# Altium schematic sheet NetCamera.SchDoc
size A3
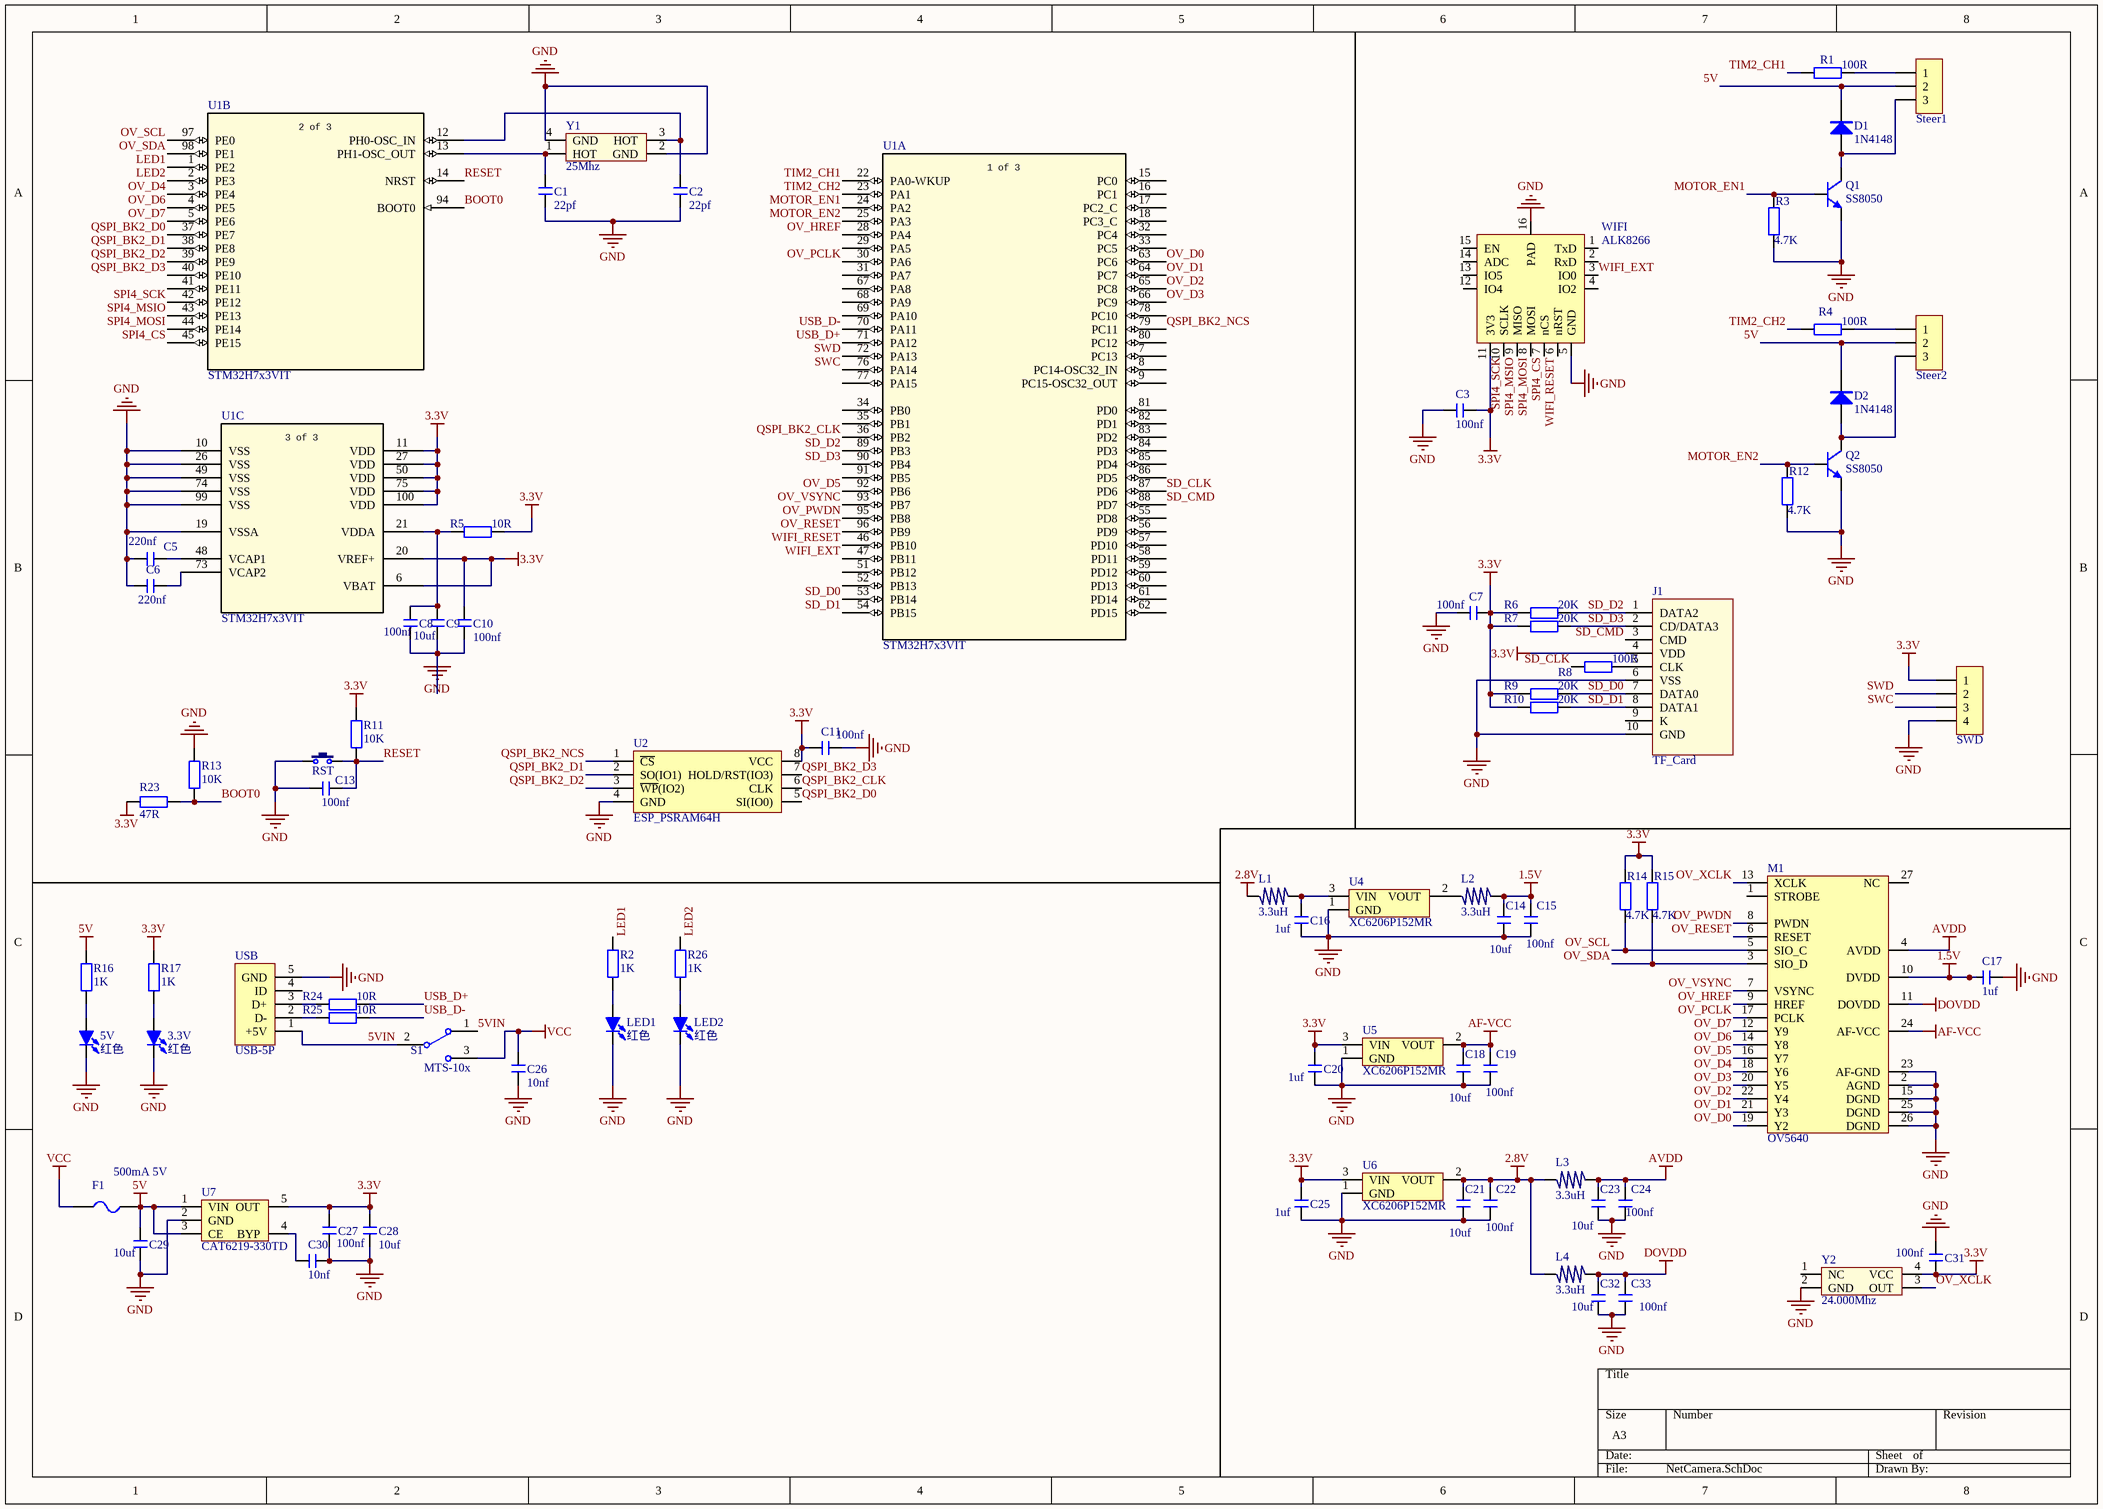
[diagram p0: NetCamera.SchDoc]

## Parts
3.3V  红色  [LED 0603R]
5V  红色  [LED 0603R]
C1  22pf  [C 0603_L]
C2  22pf  [C 0603_L]
C3  100nf  [C 0603_L]
C5  220nf  [C 0603_L]
C6  220nf  [C 0603_L]
C7  100nf  [C 0603_L]
C8  100nf  [C 0603_L]
C9  10uf  [C 0603_L]
C10  100nf  [C 0603_L]
C11  100nf  [C 0603_L]
C13  100nf  [C 0603_L]
C14  10uf  [C 0805_L]
C15  100nf  [C 0603_L]
C16  1uf  [C 0603_L]
C17  1uf  [C 0805_L]
C18  10uf  [C 0805_L]
C19  100nf  [C 0603_L]
C20  1uf  [C 0603_L]
C21  10uf  [C 0805_L]
C22  100nf  [C 0603_L]
C23  10uf  [C 0805_L]
C24  100nf  [C 0603_L]
C25  1uf  [C 0603_L]
C26  10nf  [C 0805_L]
C27  100nf  [C 0603_L]
C28  10uf  [C 0805_L]
C29  10uf  [C 0603_L]
C30  10nf  [C 0603_L]
C31  100nf  [C 0603_L]
C32  10uf  [C 0805_L]
C33  100nf  [C 0603_L]
D1  1N4148  [SOD-323]
D2  1N4148  [SOD-323]
F1  500mA 5V  [FU 0805]
J1  TF_Card  [Micro SD]
L1  3.3uH  [L 0805]
L2  3.3uH  [L 0805]
L3  3.3uH  [L 0805]
L4  3.3uH  [L 0805]
LED1  红色  [LED 0603R]
LED2  红色  [LED 0603R]
M1  OV5640  [OV5640-24]
Q1  SS8050  [SOT23-3N]
Q2  SS8050  [SOT23-3N]
R1  100R  [R 0603_L]
R2  1K  [R 0603_L]
R3  4.7K  [R 0603_L]
R4  100R  [R 0603_L]
R5  10R  [R 0603_L]
R6  20K  [R 0603_L]
R7  20K  [R 0603_L]
R8  100R  [R 0603_L]
R9  20K  [R 0603_L]
R10  20K  [R 0603_L]
R11  10K  [R 0603_L]
R12  4.7K  [R 0603_L]
R13  10K  [R 0603_L]
R14  4.7K  [R 0603_L]
R15  4.7K  [R 0603_L]
R16  1K  [R 0603_L]
R17  1K  [R 0603_L]
R23  47R  [R 0603_L]
R24  10R  [R 0603_L]
R25  10R  [R 0603_L]
R26  1K  [R 0603_L]
RST  3x6x5  [TSW SMD-3*6*2.5]  (value not drawn)
S1  MTS-10x  [8.5*3.5_弯3P]
Steer1  HDR-1X3  [HDR2.54-LI-3P]  (value not drawn)
Steer2  HDR-1X3  [HDR2.54-LI-3P]  (value not drawn)
SWD  HDR-1X4  [HDR2.54-M-LI-4P]  (value not drawn)
U1  STM32H7x3VIT  [LQFP100_14x14mm]  (parts A,B,C of 3)
U2  ESP_PSRAM64H  [SOP8_N]
U4  XC6206P152MR  [SOT-23]
U5  XC6206P152MR  [SOT-23]
U6  XC6206P152MR  [SOT-23]
U7  CAT6219-330TD  [SOT-23-5]
USB  USB-5P  [USB-MICRO_B]
WIFI  ALK8266  [ALK8266]
Y1  25Mhz  [XTAL3225]
Y2  24.000Mhz  [XTAL3225]

## Nets
1.5V: C14.2 C15.2 C17.2 L2.2 M1.10(DVDD)
2.8V: C21.2 C22.2 L1.1 L3.1 L4.1 U6.2(VOUT)
3.3V: C3.1 C7.1 C10.2 C11.2 C20.2 C25.2 C27.2 C28.2 C31.1 J1.4(VDD) R5.2 R6.2 R7.2 R9.2 R10.2 R11.2 R14.2 R15.2 R17.2 R23.2 SWD.1 U1.6(VBAT) U1.11(VDD) U1.20(VREF+) U1.27(VDD) U1.50(VDD) U1.75(VDD) U1.100(VDD) U2.8(VCC) U5.3(VIN) U6.3(VIN) U7.5(OUT) WIFI.11(3V3) Y2.4(VCC)
5V: C29.2 D1.2(K) D2.2(K) F1.2 R16.2 Steer1.2 Steer2.2 U7.1(VIN) U7.3(CE)
AF-VCC: C18.2 C19.2 M1.24(AF-VCC) U5.2(VOUT)
AVDD: C23.2 C24.2 L3.2 M1.4(AVDD)
DOVDD: C32.2 C33.2 L4.2 M1.11(DOVDD)
GND: 3.3V.2(K) 5V.2(K) C1.1 C2.1 C3.2 C5.2 C6.2 C7.2 C8.1 C9.1 C10.1 C11.1 C13.2 C14.1 C15.1 C16.1 C17.1 C18.1 C19.1 C20.1 C21.1 C22.1 C23.1 C24.1 C25.1 C26.1 C27.1 C28.1 C29.1 C30.1 C31.2 C32.1 C33.1 J1.6(VSS) J1.10(GND) LED1.2(K) LED2.2(K) M1.2(AGND) M1.15(DGND) M1.23(AF-GND) M1.25(DGND) M1.26(DGND) Q1.2(E) Q2.2(E) R3.1 R12.1 R13.2 RST.1 SWD.4 U1.10(VSS) U1.19(VSSA) U1.26(VSS) U1.49(VSS) U1.74(VSS) U1.99(VSS) U2.4(GND) U4.1(GND) U5.1(GND) U6.1(GND) U7.2(GND) USB.5(GND) WIFI.5(GND) WIFI.16(PAD) Y1.2(GND) Y1.4(GND) Y2.2(GND)
VCC: C26.2 F1.1 S1.3
5VIN: S1.1 S1.2 USB.1(+5V)
BOOT0: R13.1 R23.1 U1.94(BOOT0)
LED1: R2.2 U1.1(PE2)
LED2: R26.2 U1.2(PE3)
MOTOR_EN1: Q1.1(B) R3.2 U1.24(PA2)
MOTOR_EN2: Q2.1(B) R12.2 U1.25(PA3)
OV_D0: M1.19(Y2) U1.63(PC6)
OV_D1: M1.21(Y3) U1.64(PC7)
OV_D2: M1.22(Y4) U1.65(PC8)
OV_D3: M1.20(Y5) U1.66(PC9)
OV_D4: M1.18(Y6) U1.3(PE4)
OV_D5: M1.16(Y7) U1.92(PB6)
OV_D6: M1.14(Y8) U1.4(PE5)
OV_D7: M1.12(Y9) U1.5(PE6)
OV_HREF: M1.9(HREF) U1.28(PA4)
OV_PCLK: M1.17(PCLK) U1.30(PA6)
OV_PWDN: M1.8(PWDN) U1.95(PB8)
OV_RESET: M1.6(RESET) U1.96(PB9)
OV_SCL: M1.5(SIO_C) R14.1 U1.97(PE0)
OV_SDA: M1.3(SIO_D) R15.1 U1.98(PE1)
OV_VSYNC: M1.7(VSYNC) U1.93(PB7)
OV_XCLK: M1.13(XCLK) Y2.3(OUT)
QSPI_BK2_CLK: U1.36(PB2) U2.6(CLK)
QSPI_BK2_D0: U1.37(PE7) U2.5(SI(IO0))
QSPI_BK2_D1: U1.38(PE8) U2.2(SO(IO1))
QSPI_BK2_D2: U1.39(PE9) U2.3(~{WP}(IO2))
QSPI_BK2_D3: U1.40(PE10) U2.7(HOLD/RST(IO3))
QSPI_BK2_NCS: U1.79(PC11) U2.1(~{CS})
RESET: C13.1 R11.1 RST.2 U1.14(NRST)
SD_CLK: R8.2 U1.87(PD6)
SD_CMD: J1.3(CMD) U1.88(PD7)
SD_D0: J1.7(DATA0) R9.1 U1.53(PB14)
SD_D1: J1.8(DATA1) R10.1 U1.54(PB15)
SD_D2: J1.1(DATA2) R6.1 U1.89(PB3)
SD_D3: J1.2(CD/DATA3) R7.1 U1.90(PB4)
SPI4_CS: U1.45(PE15) WIFI.7(nCS)
SPI4_MOSI: U1.44(PE14) WIFI.8(MOSI)
SPI4_MSIO: U1.43(PE13) WIFI.9(MISO)
SPI4_SCK: U1.42(PE12) WIFI.10(SCLK)
SWC: SWD.3 U1.76(PA14)
SWD: SWD.2 U1.72(PA13)
TIM2_CH1: R1.2 U1.22(PA0-WKUP)
TIM2_CH2: R4.2 U1.23(PA1)
USB_D+: R24.2 U1.71(PA12)
USB_D-: R25.2 U1.70(PA11)
WIFI_EXT: U1.47(PB11) WIFI.3(IO0)
WIFI_RESET: U1.46(PB10) WIFI.6(nRST)
Net3.3V_1: 3.3V.1(A) R17.1
Net5V_1: 5V.1(A) R16.1
NetC1_2: C1.2 U1.13(PH1-OSC_OUT) Y1.1(HOT)
NetC2_2: C2.2 U1.12(PH0-OSC_IN) Y1.3(HOT)
NetC5_1: C5.1 U1.48(VCAP1)
NetC6_1: C6.1 U1.73(VCAP2)
NetC8_2: C8.2 C9.2 R5.1 U1.21(VDDA)
NetC16_2: C16.2 L1.2 U4.3(VIN)
NetC30_2: C30.2 U7.4(BYP)
NetD1_1: D1.1(A) Q1.3(C) Steer1.3
NetD2_1: D2.1(A) Q2.3(C) Steer2.3
NetJ1_5: J1.5(CLK) R8.1
NetL2_1: L2.1 U4.2(VOUT)
NetLED1_1: LED1.1(A) R2.1
NetLED2_1: LED2.1(A) R26.1
NetR1_1: R1.1 Steer1.1
NetR4_1: R4.1 Steer2.1
NetR24_1: R24.1 USB.3(D+)
NetR25_1: R25.1 USB.2(D-)

Not connected (* = marked no-connect by the designer): J1 9(K); M1 1(STROBE) 27(NC); U1 7(PC13) 8(PC14-OSC32_IN) 9(PC15-OSC32_OUT) 15(PC0) 16(PC1) 17(PC2_C) 18(PC3_C) 29(PA5) 31(PA7) 32(PC4) 33(PC5) 34(PB0) 35(PB1) 41(PE11) 51(PB12) 52(PB13) 55(PD8) 56(PD9) 57(PD10) 58(PD11) 59(PD12) 60(PD13) 61(PD14) 62(PD15) 67(PA8) 68(PA9) 69(PA10) 77(PA15) 78(PC10) 80(PC12) 81(PD0) 82(PD1) 83(PD2) 84(PD3) 85(PD4) 86(PD5) 91(PB5); USB 4(ID); WIFI 1(TxD) 2(RxD) 4(IO2) 12(IO4) 13(IO5) 14(ADC) 15(EN); Y2 1(NC)

## Notes on the sheet
- (in symbol STM32H7x3VIT, part A) 1 of 3
- (in symbol STM32H7x3VIT, part B) 2 of 3
- (in symbol STM32H7x3VIT, part C) 3 of 3

## Library data of the parts
3.3V 5V LED1 LED2 = LED-SMD: 贴片LED; 版权归属: 源创客; BOM名称: 贴片LED; 学习资源: www.ooocke.com
C1-C3 C5-C11 C13-C33 = C: 无极性贴片电容; 版权归属: 源创客; BOM名称: 无极性贴片电容; 学习资源: www.ooocke.com
D1 D2 = 1N4148: 高速开关二极管; 版权归属: 源创客; BOM名称: 高速开关二极管; 学习资源: www.ooocke.com
F1 = FU: 贴片保险丝; 版权归属: 源创客; BOM名称: 贴片保险丝; 学习资源: www.ooocke.com
J1 = TF_Card: TF卡座; 版权归属: 源创客; BOM名称: TF卡座; 学习资源: www.ooocke.com
L1-L4 = L
M1 = OV5640: OV5640模组,AF,FPC
Q1 Q2 = 8050-SMD: 高频放大-NPN型; 版权归属: 源创客; 属性: 40V 1.5A 1W 100MHZ; BOM名称: 高频放大-NPN型; 学习资源: www.ooocke.com
R1-R17 R23-R26 = R: 贴片电阻; 版权归属: 源创客; BOM名称: 贴片电阻; 学习资源: www.ooocke.com
RST = TSW 3x6: 3x6轻触开关; 版权归属: 源创客; BOM名称: 3x6轻触开关; 学习资源: www.ooocke.com
S1 = MTS-10x: MTS10x系列3脚扭子开关; 版权归属: 源创客; BOM名称: MTS10x系列3脚扭子开关; 学习资源: www.ooocke.com
Steer1 Steer2 = Header 3: 3P接插件; 版权归属: 源创客; BOM名称: 3P接插件; 学习资源: www.ooocke.com
SWD = Header 4: 4P接插件; 版权归属: 源创客; BOM名称: 4P接插件; 学习资源: www.ooocke.com
U1 = STM32H7x3VIT: Imported; Vendor: STMicroelectronics; Copyright: Copyright (C) 2016 Accelerated Designs. All rights reserved; Manufacturer_Part_Number: stm32h7x3vit; Value: Value; Type: Type; RefDes: RefDes
U2 = W25Q128
U4-U6 = XC6206: LDO,SOT23,1.2~5.0V
U7 = CAT6219-330TD: 3.3V 500mA LDO
USB = USB-5P: 微型USB母座; 版权归属: 源创客; BOM名称: 微型USB母座; 学习资源: www.ooocke.com
Y1 = XTAL_3225: 3225贴片无源晶振
Y2 = XTAL_S: 有源晶振